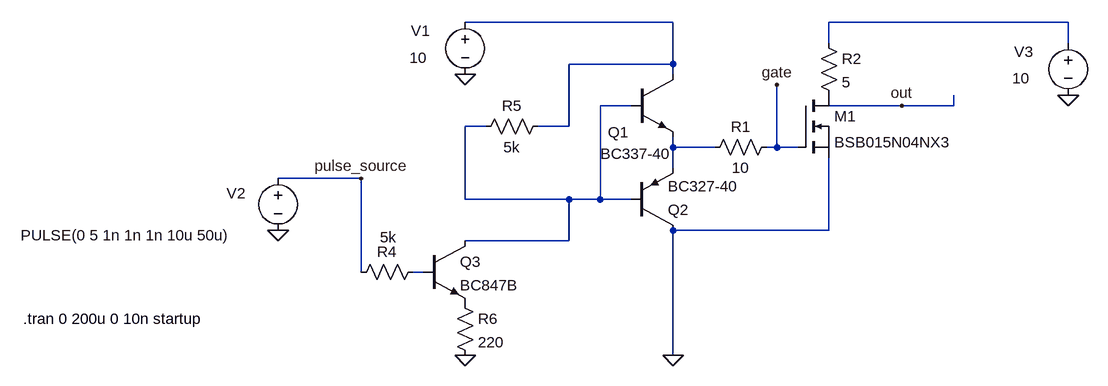
[diagram p0: schematic totem-pole driver low side.asc]
totem-pole driver low side.asc, the LTspice schematic file:
Version 4
SHEET 1 1708 680
WIRE -192 32 -512 32
WIRE 416 32 48 32
WIRE 48 64 48 32
WIRE 416 64 416 32
WIRE -192 96 -192 32
WIRE -192 96 -352 96
WIRE -192 112 -192 96
WIRE -256 160 -304 160
WIRE 160 160 48 160
WIRE 240 160 240 144
WIRE 240 160 160 160
WIRE -480 192 -512 192
WIRE -352 192 -352 96
WIRE -352 192 -400 192
WIRE -192 224 -192 208
WIRE -128 224 -192 224
WIRE -32 224 -32 128
WIRE -32 224 -48 224
WIRE 0 224 -32 224
WIRE -192 256 -192 224
WIRE -672 272 -800 272
WIRE -512 304 -512 192
WIRE -352 304 -512 304
WIRE -304 304 -304 160
WIRE -304 304 -352 304
WIRE -256 304 -304 304
WIRE 48 352 48 240
WIRE 48 352 -192 352
WIRE -352 368 -352 304
WIRE -352 368 -512 368
WIRE -672 416 -672 272
WIRE -576 416 -592 416
WIRE -192 544 -192 352
FLAG -512 112 0
FLAG -800 352 0
FLAG -672 272 pulse_source
FLAG 160 160 out
FLAG -32 128 gate
FLAG -192 544 0
FLAG -512 544 0
FLAG 416 144 0
SYMBOL npn -256 112 R0
WINDOW 0 -36 89 Left 2
WINDOW 3 -48 122 Left 2
SYMATTR InstName Q1
SYMATTR Value BC337-40
SYMBOL pnp -256 352 M180
SYMATTR InstName Q2
SYMATTR Value BC327-40
SYMBOL voltage -512 16 R0
WINDOW 0 -83 29 Left 2
WINDOW 3 -86 70 Left 2
WINDOW 123 0 0 Left 0
WINDOW 39 0 0 Left 0
SYMATTR InstName V1
SYMATTR Value 10
SYMBOL voltage -800 256 R0
WINDOW 0 -79 39 Left 2
WINDOW 3 -396 103 Left 2
WINDOW 123 0 0 Left 0
WINDOW 39 0 0 Left 0
SYMATTR InstName V2
SYMATTR Value PULSE(0 5 1n 1n 1n 10u 50u)
SYMBOL npn -576 368 R0
SYMATTR InstName Q3
SYMATTR Value BC847B
SYMBOL res -576 400 R90
WINDOW 0 0 56 VBottom 2
WINDOW 3 -53 54 VTop 2
SYMATTR InstName R4
SYMATTR Value 5k
SYMBOL res -32 208 R90
WINDOW 0 0 56 VBottom 2
WINDOW 3 32 56 VTop 2
SYMATTR InstName R1
SYMATTR Value 10
SYMBOL res 32 48 R0
SYMATTR InstName R2
SYMATTR Value 5
SYMBOL nmos 0 144 R0
SYMATTR InstName M1
SYMATTR Value BSB015N04NX3
SYMBOL res -384 176 R90
WINDOW 0 0 56 VBottom 2
WINDOW 3 32 56 VTop 2
SYMATTR InstName R5
SYMATTR Value 5k
SYMBOL res -528 448 R0
SYMATTR InstName R6
SYMATTR Value 220
SYMBOL voltage 416 48 R0
WINDOW 0 -83 29 Left 2
WINDOW 3 -86 70 Left 2
WINDOW 123 0 0 Left 0
WINDOW 39 0 0 Left 0
SYMATTR InstName V3
SYMATTR Value 10
TEXT -1192 488 Left 2 !.tran 0 200u 0 10n startup

The netlist it stands for:
* totem-pole driver low side.asc
Q1 N001 N003 N004 0 BC337-40
Q2 0 N003 N004 0 BC327-40
V1 N001 0 10
V2 pulse_source 0 PULSE(0 5 1n 1n 1n 10u 50u)
Q3 N003 N005 P001 0 BC847B
R4 N005 pulse_source 5k
R1 gate N004 10
R2 N002 P002 5
M1 P002 gate 0 0 BSB015N04NX3
R5 N001 N003 5k
R6 P001 0 220
V3 N002 0 10
.model NPN NPN
.model PNP PNP
.lib standard.bjt
.model NMOS NMOS
.model PMOS PMOS
.lib standard.mos
.tran 0 200u 0 10n startup
.backanno
.end